# Altium schematic sheet Front(LDR).SchDoc
size A4; SheetNumber: 3; SheetTotal: 4
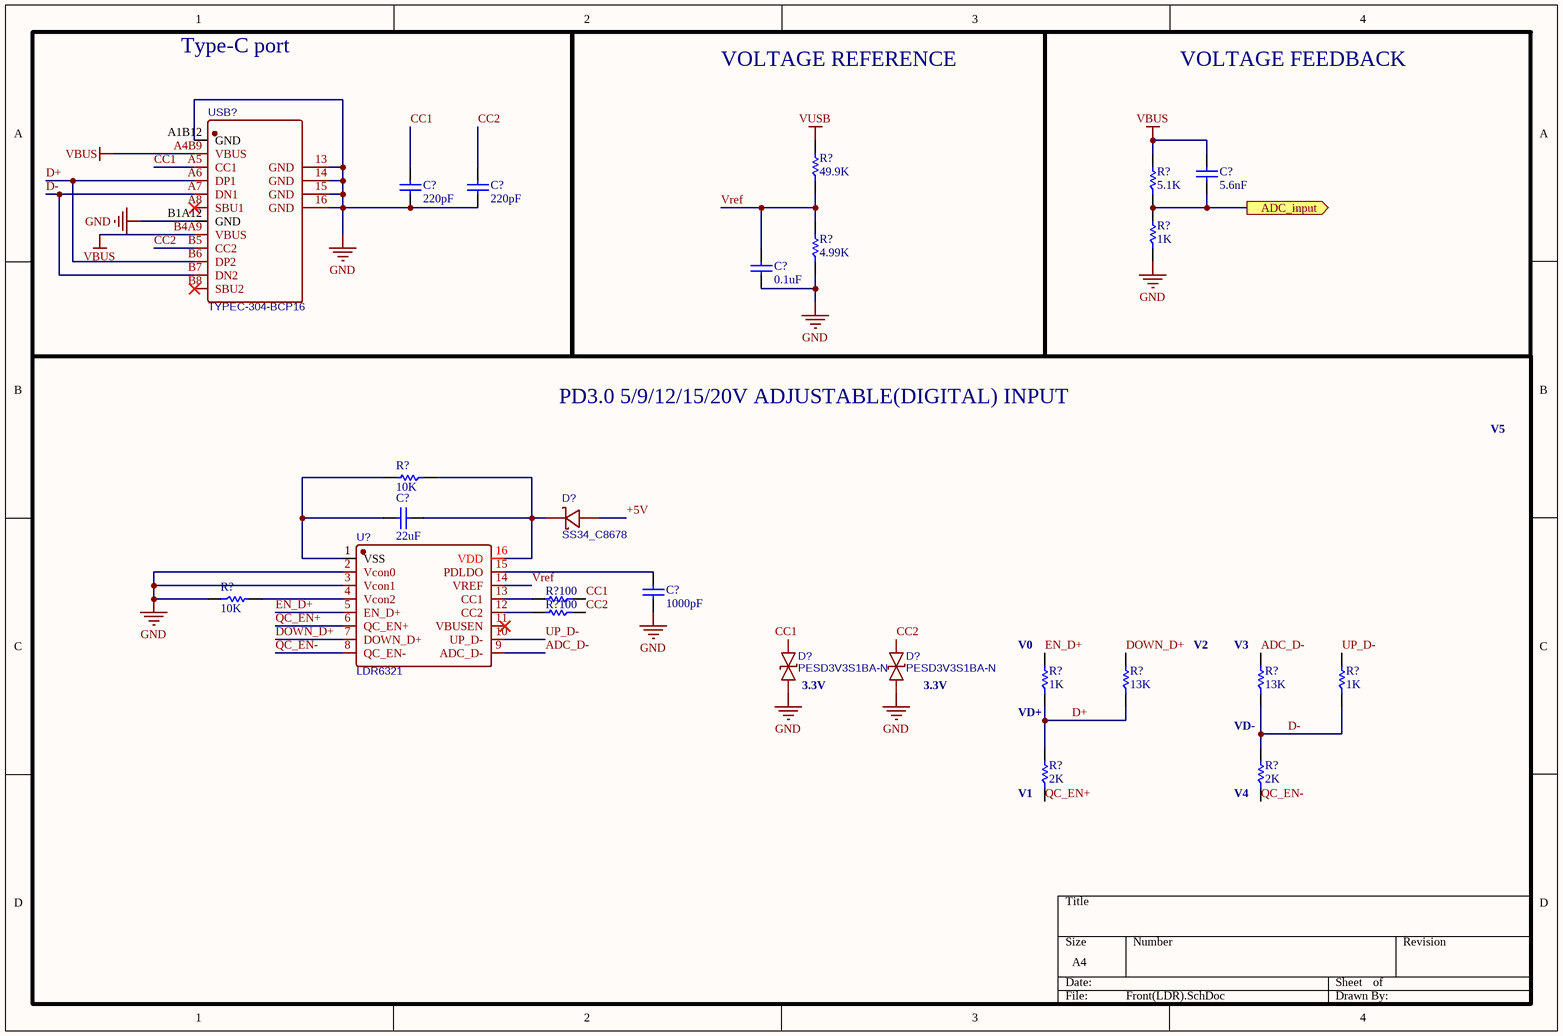
[diagram p0: Front(LDR).SchDoc]

## Parts
(Parts that share a designator on the sheet are numbered #1, #2 ... from top to bottom, then left to right.)
C?#1  220pF  [0805C]
C?#2  220pF  [0805C]
C?#3  5.6nF  [0805C]
C?#4  0.1uF  [0805C]
C?#5  22uF  [0805C]
C?#6  1000pF  [0805C]
D?#1  SS34_C8678  [DO-214AC_L4.3-W2.7-LS5.3-RD]
D?#2  PESD3V3S1BA-N  [SOD-523_L1.2-W0.8-LS1.6-BI]
D?#3  PESD3V3S1BA-N  [SOD-523_L1.2-W0.8-LS1.6-BI]
R?#1  49.9K  [0805]
R?#2  5.1K  [0805]
R?#3  1K  [0805]
R?#4  4.99K  [0805]
R?#5  10K  [0805]
R?#6  10K  [0805]
R?#7  100  [0805]
R?#8  100  [0805]
R?#9  1K  [0805]
R?#10  13K  [0805]
R?#11  13K  [0805]
R?#12  1K  [0805]
R?#13  2K  [0805]
R?#14  2K  [0805]
U?  LDR6321  [SSOP-16_L5.0-W4.4-P0.65-LS6.4-BL]
USB?  TYPEC-304-BCP16  [USB-C-SMD_TYPEC-304-BCP16]

## Blocks framed on the sheet
Type-C port: C?#1 C?#2 USB?

## Ports
ADC_input (out)

## Nets
GND: C?#1.1 C?#2.1 C?#4.2 C?#6.2 D?#2.1 D?#3.1 R?#3.1 R?#4.1 R?#6.1 U?.2(Vcon0) U?.3(Vcon1) USB?.13(GND) USB?.14(GND) USB?.15(GND) USB?.16(GND) USB?.A1B12(GND) USB?.B1A12(GND)
VBUS: C?#3.1 R?#2.2 USB?.A4B9(VBUS) USB?.B4A9(VBUS)
VUSB: R?#1.2
+5V: D?#1.2(A)
ADC_D-: R?#11.2 U?.9(ADC_D-)
ADC_input: C?#3.2 R?#2.1 R?#3.2 ; port ADC_input
CC1: C?#1.2 R?#7.1 USB?.A5(CC1)
CC2: C?#2.2 D?#3.2 R?#8.1 USB?.B5(CC2)
D+: R?#9.1 R?#10.1 R?#13.2 USB?.A6(DP1) USB?.B6(DP2)
D-: R?#11.1 R?#12.1 R?#14.2 USB?.A7(DN1) USB?.B7(DN2)
DOWN_D+: R?#10.2 U?.7(DOWN_D+)
EN_D+: R?#9.2 U?.5(EN_D+)
QC_EN+: R?#13.1 U?.6(QC_EN+)
QC_EN-: R?#14.1 U?.8(QC_EN-)
UP_D-: R?#12.2 U?.10(UP_D-)
Vref: C?#4.1 R?#1.1 R?#4.2 U?.14(VREF)
NetC?#5_1: C?#5.1 R?#5.2 U?.1(VSS)
NetC?#5_2: C?#5.2 D?#1.1(K) R?#5.1 U?.16(VDD)
NetC?#6_1: C?#6.1 U?.15(PDLDO)
NetR?#6_2: R?#6.2 U?.4(Vcon2)
NetR?#7_2: R?#7.2 U?.13(CC1)
NetR?#8_2: R?#8.2 U?.12(CC2)

Not connected (* = marked no-connect by the designer): D?#2 2; U? 11(VBUSEN)*; USB? A8(SBU1)* B8(SBU2)*

## Notes on the sheet
- VOLTAGE REFERENCE
- VOLTAGE FEEDBACK
- PD3.0 5/9/12/15/20V ADJUSTABLE(DIGITAL) INPUT
- V5
- (near R?#9) V0
- V2
- (near R?#11) V3
- (near D?#2) 3.3V
- (near D?#3) 3.3V
- (near R?#9) VD+
- (near R?#11) VD-
- (near R?#13) V1
- (near R?#14) V4
- Labels drawn without touching a wire or pin: CC1

## Library data of the parts
C?#1-C?#3 C?#5 C?#6 = C_7: Capacitor; Reviewed by: RM - 2018/08/05; Revision: July-2002: Re-released for DXP Platform.; Supplier 1: *; Supplier Part Number 1: *
  C?#1 C?#2: Value: 220pF
  C?#3: Value: 5.6nF
  C?#5: Value: 22uF
  C?#6: Value: 1000pF
C?#4 = C_6: Capacitor; Reviewed by: RM - 2018/08/05; Revision: July-2002: Re-released for DXP Platform.; Supplier 1: *; Supplier Part Number 1: *; Value: 0.1uF
D?#1 = SS34_C8678: BOM_Manufacturer Part: SS34; BOM_Manufacturer: MDD; BOM_Supplier: LCSC; BOM_Supplier Part: C8678; BOM_JLCPCB Part Class: Basic Part; spicePre: D; spiceSymbolName: SS34_C8678
D?#2 D?#3 = PESD3V3S1BA-N: TVS3V3; BOM_Manufacturer: Bourne Semicon (Shenzhen); Contributor: LCSC; BOM_Supplier: LCSC; BOM_Supplier Part: C316037; BOM_Manufacturer Part: PESD3V3S1BA-N; BOM_JLCPCB Part Class: Extended Part; spicePre: D; spiceSymbolName: PESD3V3S1BA-N
R?#1 R?#2 R?#4-R?#14 = R_1: Resistor; Reviewed by: RM - 2018/08/05; Supplier 1: *; Suppler Part Number 1: *
  R?#1: Value: 49.9K
  R?#2: Value: 5.1K
  R?#4: Value: 4.99K
  R?#5 R?#6: Value: 10K
  R?#7 R?#8: Value: 100
  R?#9 R?#12: Value: 1K
  R?#10 R?#11: Value: 13K
  R?#13 R?#14: Value: 2K
R?#3 = R_6: Resistor; Reviewed by: RM - 2018/08/05; Supplier 1: *; Suppler Part Number 1: *; Value: 1K
U? = LDR6321: BOM_Manufacturer: Legendary(乐得瑞); Contributor: LCSC; BOM_Supplier: LCSC; BOM_Supplier Part: C2919632; BOM_Manufacturer Part: LDR6321; BOM_JLCPCB Part Class: Extended Part; spicePre: U; spiceSymbolName: LDR6321
USB? = TYPEC-304-BCP16: BOM_Manufacturer: XUNPU; Contributor: LCSC; BOM_Supplier: LCSC; BOM_Supplier Part: C720629; BOM_Manufacturer Part: TYPEC-304-BCP16; BOM_JLCPCB Part Class: Extended Part; spicePre: U; spiceSymbolName: TYPEC-304-BCP16